# EAGLE design mc (EAGLE 4.16)
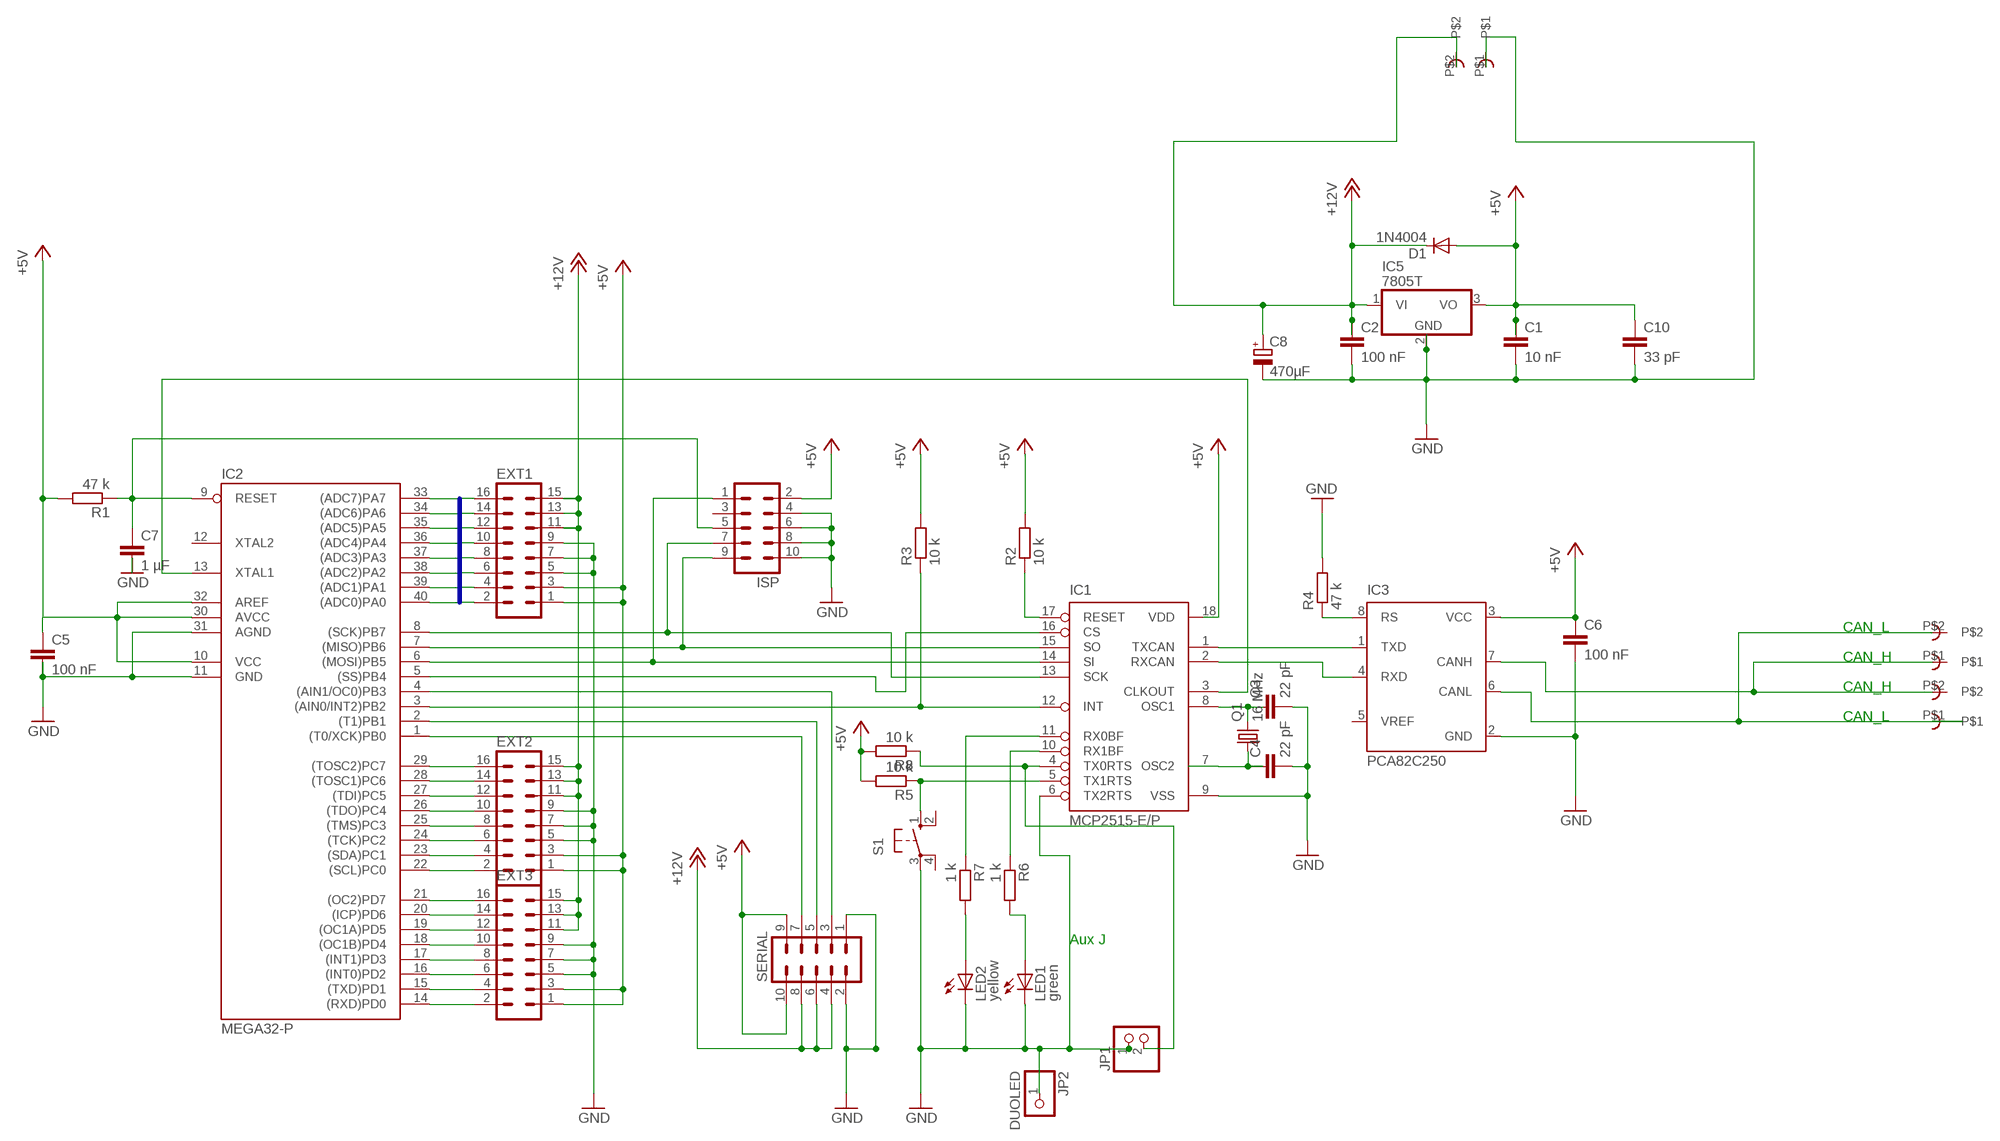
[diagram p0: schematic, sheet 1]

## Parts
C1  10 nF  C-EU025-030X050  [C025-030X050]
C2  100 nF  C-EU025-030X050  [C025-030X050]
C3  22 pF  C-EU025-030X050  [C025-030X050]
C4  22 pF  C-EU025-030X050  [C025-030X050]
C5  100 nF  C-EU025-030X050  [C025-030X050]
C6  100 nF  C-EU025-030X050  [C025-030X050]
C7  1 µF  C-EU025-030X050  [C025-030X050]
C8  470µF  CPOL-EUE2,5-6E  [E2,5-6E]
C10  33 pF  C-EU025-030X050  [C025-030X050]
CAN-1  RIACON101-2  [RIACON101-2]
CAN-2  RIACON101-2  [RIACON101-2]
D1  1N4004  [DO41-10]
EXT1  ML16  [ML16]
EXT2  ML16  [ML16]
EXT3  ML16  [ML16]
IC1  MCP2515-E/P  [DIL18]
IC2  MEGA32-P  [DIL40]
IC3  PCA82C250  [DIL08]
IC5  7805T  [TO220H]
ISP  ML10  [ML10]
JP1  PINHD-1X2  [1X02]
JP2  DUOLED  PINHD-1X1  [1X01]
LED1  green  LED3MM  [LED3MM]
LED2  yellow  LED3MM  [LED3MM]
POWER  RIACON101-2  [RIACON101-2]
Q1  16 MHz  CRYSTALHC49U70  [HC49U70]
R1  47 k  R-EU_0204/2V  [0204V]
R2  10 k  R-EU_0204/2V  [0204V]
R3  10 k  R-EU_0204/2V  [0204V]
R4  47 k  R-EU_0204/2V  [0204V]
R5  10 k  R-EU_0204/2V  [0204V]
R6  1 k  R-EU_0204/2V  [0204V]
R7  1 k  R-EU_0204/2V  [0204V]
R8  10 k  R-EU_0204/2V  [0204V]
S1  10-XX  [B3F-10XX]
SERIAL  ML10  [ML10]

## Nets
+5V: C1.1 C5.1 C6.1 C10.1 D1.A EXT1.1 EXT1.3 EXT2.1 EXT2.3 EXT3.1 EXT3.3 IC1.18(VDD) IC2.10(VCC) IC2.30(AVCC) IC2.32(AREF) IC3.3(VCC) IC5.3(VO) ISP.2 R1.2 R2.2 R3.2 R5.2 R8.2 SERIAL.9 SERIAL.10
+12V: C2.1 C8.+ D1.C EXT1.11 EXT1.13 EXT1.15 EXT2.11 EXT2.13 EXT2.15 EXT3.11 EXT3.13 EXT3.15 IC5.1(VI) POWER.P$2 SERIAL.4 SERIAL.6 SERIAL.8
AUX_JMP: IC1.4(TX0RTS) JP1.2 R8.1
BUSA0: EXT1.2 IC2.33((ADC7)PA7)
BUSA1: EXT1.4 IC2.34((ADC6)PA6)
BUSA2: EXT1.6 IC2.35((ADC5)PA5)
BUSA3: EXT1.8 IC2.36((ADC4)PA4)
BUSA4: EXT1.10 IC2.37((ADC3)PA3)
BUSA5: EXT1.12 IC2.38((ADC2)PA2)
BUSA6: EXT1.14 IC2.39((ADC1)PA1)
BUSA7: EXT1.16 IC2.40((ADC0)PA0)
CANH: CAN-1.P$1 CAN-2.P$2 IC3.7(CANH)
CANL: CAN-1.P$2 CAN-2.P$1 IC3.6(CANL)
CLOCK: IC1.3(CLKOUT) IC2.13(XTAL1)
GND: C1.2 C2.2 C3.2 C4.2 C5.2 C6.2 C7.2 C8.- C10.2 EXT1.5 EXT1.7 EXT1.9 EXT2.5 EXT2.7 EXT2.9 EXT3.5 EXT3.7 EXT3.9 IC1.6(TX2RTS) IC1.9(VSS) IC2.11(GND) IC2.31(AGND) IC3.2(GND) IC5.2(GND) ISP.4 ISP.6 ISP.8 ISP.10 JP1.1 JP2.1 LED1.K(C) LED2.K(C) POWER.P$1 R4.2 S1.3(P) SERIAL.1 SERIAL.2
INT: IC1.12(INT) IC2.3((AIN0/INT2)PB2) R3.1
LED_G: IC1.10(RX1BF) R6.1
LED_Y: IC1.11(RX0BF) R7.1
MCP_CS: IC1.16(CS) IC2.5((SS)PB4)
MISO: IC1.15(SO) IC2.7((MISO)PB6) ISP.9
MOSI: IC1.14(SI) IC2.6((MOSI)PB5) ISP.1
N$1: IC3.8(RS) R4.1
N$15: IC1.5(TX1RTS) R5.1 S1.1(S)
N$18: IC1.17(RESET) R2.1
N$28: EXT2.2 IC2.22((SCL)PC0)
N$29: EXT2.4 IC2.23((SDA)PC1)
N$30: EXT2.6 IC2.24((TCK)PC2)
N$31: EXT2.8 IC2.25((TMS)PC3)
N$32: EXT2.10 IC2.26((TDO)PC4)
N$33: EXT2.12 IC2.27((TDI)PC5)
N$34: EXT2.14 IC2.28((TOSC1)PC6)
N$35: EXT2.16 IC2.29((TOSC2)PC7)
N$36: EXT3.2 IC2.14((RXD)PD0)
N$37: EXT3.4 IC2.15((TXD)PD1)
N$38: EXT3.6 IC2.16((INT0)PD2)
N$39: EXT3.8 IC2.17((INT1)PD3)
N$40: EXT3.10 IC2.18((OC1B)PD4)
N$41: EXT3.12 IC2.19((OC1A)PD5)
N$42: EXT3.14 IC2.20((ICP)PD6)
N$43: EXT3.16 IC2.21((OC2)PD7)
N$46: LED2.A R7.2
N$47: LED1.A R6.2
OSC1: C3.1 IC1.8(OSC1) Q1.2
OSC2: C4.1 IC1.7(OSC2) Q1.1
RESET: C7.1 IC2.9(RESET) ISP.5 R1.1
RXCAN: IC1.2(RXCAN) IC3.4(RXD)
SCK: IC1.13(SCK) IC2.8((SCK)PB7) ISP.7
SERIAL_1: IC2.4((AIN1/OC0)PB3) SERIAL.3
SERIAL_2: IC2.2((T1)PB1) SERIAL.5
SERIAL_3: IC2.1((T0/XCK)PB0) SERIAL.7
TXCAN: IC1.1(TXCAN) IC3.1(TXD)
Unconnected: IC2.12(XTAL2) IC3.5(VREF) ISP.3 S1.2(S1) S1.4(P1)

## Buses
BUSA[0..7]

## Notes on the sheet
- CAN_L
- CAN_H
- CAN_H
- CAN_L
- Aux J

## Library data of the parts
C1-C7 C10 = rcl:C-EU: CAPACITOR, European symbol
C8 = rcl:CPOL-EU: POLARIZED CAPACITOR, European symbol
CAN-1 CAN-2 POWER = con-riacon101-v2:RIACON101-2: Riaconn Schreaubklemme 101
D1 = diode:1N4004: DIODE general purpose rectifier, 1 A
EXT1-EXT3 = con-harting-ml:ML16: HARTING
IC1 = mcp2515:MCP2515
IC2 = atmel:MEGA32-P: MICROCONTROLLER 32 Kbytes FLASH 2 Kbytes SRAM 1 Kbytes EEPROM USART 8-channel 10 bit ADC Source: www.atmel.com .. doc2503.pdf
IC3 = micro-philips:PCA82C250: CAN CONTROLLER INTERFACE
IC5 = linear:78*: Positive VOLTAGE REGULATOR Source: http://cache.national.com/ds/LM/LM78L05.pdf http://www.fairchildsemi.com/ds/LM/LM7805.pdf
ISP SERIAL = con-harting-ml:ML10: HARTING
JP1 = pinhead:PINHD-1X2: PIN HEADER
JP2 = pinhead:PINHD-1X1: PIN HEADER
LED1 LED2 = led:LED: LED OSRAM: - CHIPLED LG R971, LG N971, LY N971, LG Q971, LY Q971, LO R971, LY R971 LH N974, LH R974 LS Q976, LO Q976, LY Q976 LO Q996 - Hyper CHIPLED LW Q18S LB Q993, LB Q99A, LB R99A - SideLED LS A670, LO A670, LY A670, LG A670, LP A670 LB A673, LV A673, LT A673, LW A673 LH A674 LY A675 LS A676, LA A676, LO A676, LY A676, LW A676 LS A679, LY A679, LG A679 - Hyper Micro SIDELED® LS Y876, LA Y876, LO Y876, LY Y876 LT Y87S - SmartLED LW L88C, LW L88S LB L89C, LB L89S, LG L890 LS L89K, LO L89K, LY L89K LS L896, LA L896, LO L896, LY L896 - TOPLED LS T670, LO T670, LY T670, LG T670, LP T670 LSG T670, LSP T670, LSY T670, LOP T670, LYG T670 LG T671, LOG T671, LSG T671 LB T673, LV T673, LT T673, LW T673 LH T674 LS T676, LA T676, LO T676, LY T676, LB T676, LH T676, LSB T676, LW T676 LB T67C, LV T67C, LT T67C, LS T67K, LO T67K, LY T67K, LW E67C LS E67B, LA E67B, LO E67B, LY E67B, LB E67C, LV E67C, LT E67C LW T67C LS T679, LY T679, LG T679 LS T770, LO T770, LY T770, LG T770, LP T770 LB T773, LV T773, LT T773, LW T773 LH T774 LS E675, LA E675, LY E675, LS T675 LS T776, LA T776, LO T776, LY T776, LB T776 LHGB T686 LT T68C, LB T68C - Hyper Mini TOPLED® LB M676 - Mini TOPLED Santana® LG M470 LS M47K, LO M47K, LY M47K Source: http://www.osram.convergy.de/
Q1 = crystal:CRYSTAL: CRYSTAL
R1-R8 = rcl:R-EU_: RESISTOR, European symbol
S1 = switch-omron:10-XX: OMRON SWITCH

## Board
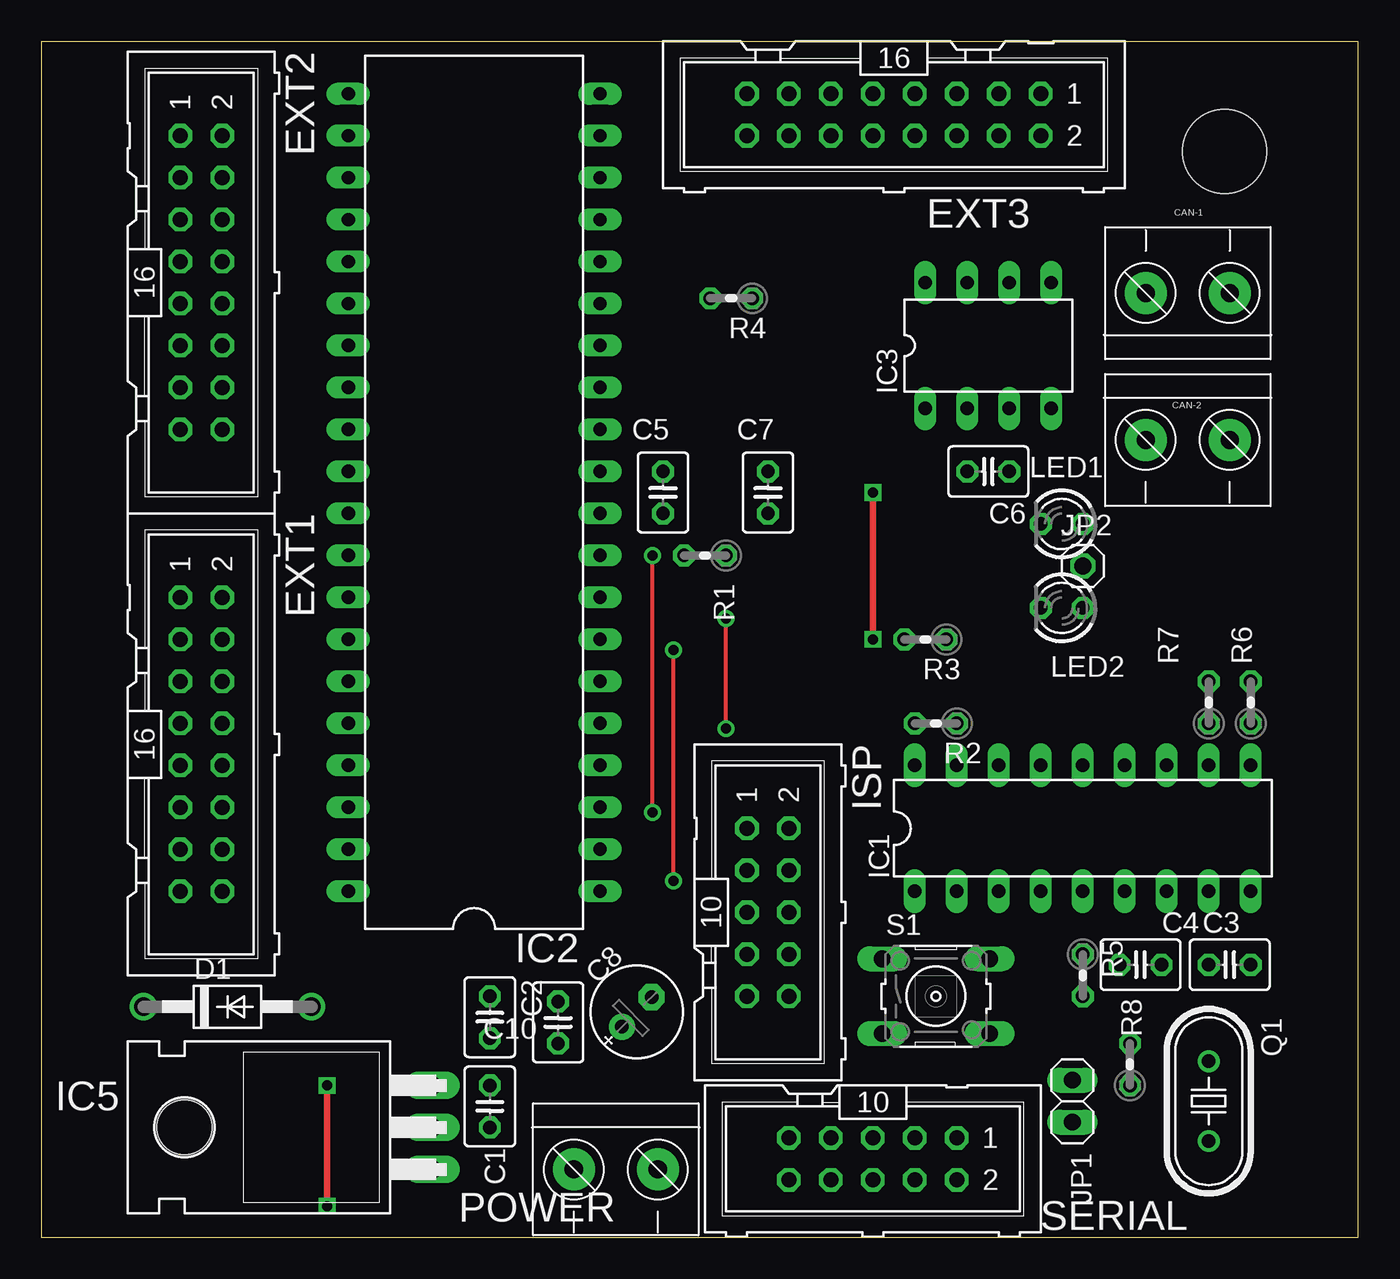
[diagram p1: board, top side]
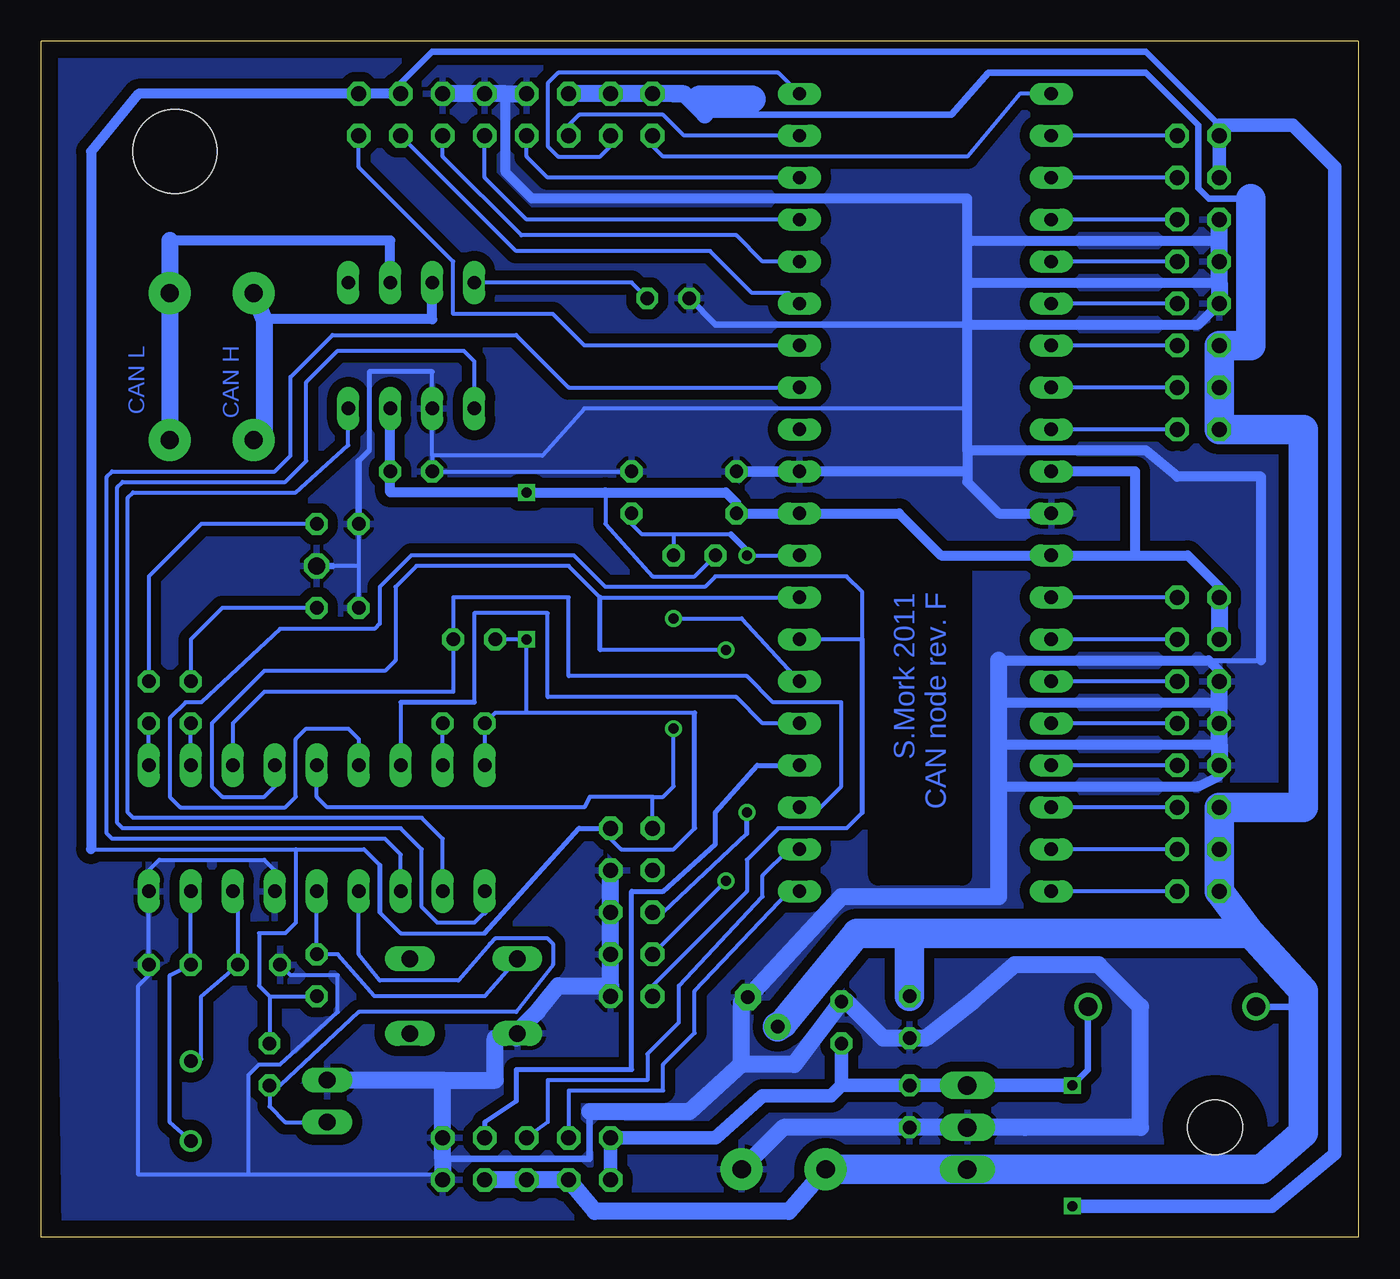
[diagram p2: board, bottom side, seen from below]

Size 79.68 x 72.38 mm. Coordinates in mm from the lower left corner, seen from the top.
Outline: 79.68,72.38 79.68,0 0,0 0,72.38
Outline: 0,72.38 79.68,72.38
Copper layers (1*16): Top 0.035mm / dielectric 1.5mm / Bottom 0.035mm
Design rules "default": minimum track width 10mil, minimum drill 24mil, track to track 8mil, track to pad 8mil, pad to pad 8mil, via to via 8mil, smd to smd 8mil, copper to edge 40mil, drill to drill 8mil, minimum pad ring 10mil, minimum via ring 8mil, stop-mask expansion 4mil, vias tented up to drill 0mil, thermal gap 10mil
Holes 5.08 mm at 71.59,65.72
tRestrict: area 0.2,0 to 5.2,72.4; area 7.1,19.7 to 12.2,40; area 7.1,47.6 to 12.2,67.9; area 51.6,29.8 to 56.7,32.4; area 51.6,19.7 to 74.4,22.2; area 47.1,56.5 to 62.4,59.1; area 52.2,48.9 to 62.4,51.4; area 31.3,19.7 to 36.3,70.5; area 17.3,19.7 to 21.1,70.5; area 64.3,15.9 to 74.4,18.4; area 61.7,14.6 to 64.3,19.7; area 51.6,27.3 to 74.4,29.8; 21 more areas
bRestrict: area 73.2,50.8 to 75.1,54; area 67.5,50.8 to 69.4,54; area 24,21.9 to 29,40.3

### Footprints (pad centres in the part's own frame; a part is rotated, then mirrored left to right if it is on the bottom)
C025-030X050 = drill 0.813 octagon: 1 -1.27,0; 2 1.27,0
E2,5-6E = drill 0.813 pad 1.575 round: + -1.27,0 | drill 0.813 pad 1.575 octagon: - 1.27,0
RIACON101-2 = drill 1.1 pad 2.54 round: P$1 0,2.54; P$2 0,-2.54
DO41-10 = drill 1.118 round: A 5.08,0; C -5.08,0
ML16 = drill 0.914 octagon: 1 -8.89,-1.27; 2 -8.89,1.27; 3 -6.35,-1.27; 4 -6.35,1.27; 5 -3.81,-1.27; 6 -3.81,1.27; 7 -1.27,-1.27; 8 -1.27,1.27; 9 1.27,-1.27; 10 1.27,1.27; 11 3.81,-1.27; 12 3.81,1.27; 13 6.35,-1.27; 14 6.35,1.27; 15 8.89,-1.27; 16 8.89,1.27
DIL18 = drill 0.813 long: 1 -10.16,-3.81; 2 -7.62,-3.81; 3 -5.08,-3.81; 4 -2.54,-3.81; 5 0,-3.81; 6 2.54,-3.81; 7 5.08,-3.81; 8 7.62,-3.81; 9 10.16,-3.81; 10 10.16,3.81; 11 7.62,3.81; 12 5.08,3.81; 13 2.54,3.81; 14 0,3.81; 15 -2.54,3.81; 16 -5.08,3.81; 17 -7.62,3.81; 18 -10.16,3.81
DIL40 = drill 0.813 long: 1 -24.13,-7.62; 2 -21.59,-7.62; 3 -19.05,-7.62; 4 -16.51,-7.62; 5 -13.97,-7.62; 6 -11.43,-7.62; 7 -8.89,-7.62; 8 -6.35,-7.62; 9 -3.81,-7.62; 10 -1.27,-7.62; 11 1.27,-7.62; 12 3.81,-7.62; 13 6.35,-7.62; 14 8.89,-7.62; 15 11.43,-7.62; 16 13.97,-7.62; 17 16.51,-7.62; 18 19.05,-7.62; 19 21.59,-7.62; 20 24.13,-7.62; 21 24.13,7.62; 22 21.59,7.62; 23 19.05,7.62; 24 16.51,7.62; 25 13.97,7.62; 26 11.43,7.62; 27 8.89,7.62; 28 6.35,7.62; 29 3.81,7.62; 30 1.27,7.62; 31 -1.27,7.62; 32 -3.81,7.62; 33 -6.35,7.62; 34 -8.89,7.62; 35 -11.43,7.62; 36 -13.97,7.62; 37 -16.51,7.62; 38 -19.05,7.62; 39 -21.59,7.62; 40 -24.13,7.62
DIL08 = drill 0.813 long: 1 -3.81,-3.81; 2 -1.27,-3.81; 3 1.27,-3.81; 4 3.81,-3.81; 5 3.81,3.81; 6 1.27,3.81; 7 -1.27,3.81; 8 -3.81,3.81
TO220H = drill 1.118 long: 1 -2.54,-10.16; 2 0,-10.16; 3 2.54,-10.16 | hole 3.302: 0,4.826
ML10 = drill 0.914 octagon: 1 -5.08,-1.27; 2 -5.08,1.27; 3 -2.54,-1.27; 4 -2.54,1.27; 5 0,-1.27; 6 0,1.27; 7 2.54,-1.27; 8 2.54,1.27; 9 5.08,-1.27; 10 5.08,1.27
1X02 = drill 1.016 long: 1 -1.27,0; 2 1.27,0
1X01 = drill 1.016 octagon: 1 0,0
LED3MM = drill 0.813 octagon: A -1.27,0; K 1.27,0
HC49U70 = drill 0.813 round: 1 -2.413,0; 2 2.413,0
0204V = drill 0.813 octagon: 1 -1.27,0; 2 1.27,0
B3F-10XX = drill 1.016 long: 1 -3.251,2.261; 2 3.251,2.261; 3 -3.251,-2.261; 4 3.251,-2.261

### Placement (x,y rotation side)
C1  27.14,7.93 270 top
C2  27.14,13.33 270 top
C3  71.91,16.51 0 top
C4  66.51,16.51 180 top
C5  37.62,45.08 90 top
C6  57.3,46.35 180 top
C7  43.97,45.08 90 top
C8  36.03,13.65 45 top
C10  31.27,13.01 90 top
CAN-1  69.37,57.15 90 top
CAN-2  69.37,48.25 270 top
D1  11.27,13.96 0 top
EXT1  9.68,29.84 270 top
EXT2  9.68,57.78 270 top
EXT3  51.59,67.94 180 top
IC1  63.02,24.76 0 top
IC2  26.19,45.08 90 top
IC3  57.3,53.97 0 top
IC5  13.49,6.66 90 top
ISP  43.97,19.68 270 top
JP1  62.38,8.25 270 top
JP2  63.02,40.63 0 top
LED1  61.75,43.17 180 top
LED2  61.75,38.09 180 top
POWER  34.76,4.12 270 top
Q1  70.64,8.25 270 top
R1  40.16,41.27 180 top
R2  54.13,31.11 180 top
R3  53.49,36.19 180 top
R4  41.75,56.83 180 top
R5  63.02,15.87 270 top
R6  73.18,32.38 90 top
R7  70.64,32.38 90 top
R8  65.88,10.47 90 top
S1  54.13,14.6 0 top
SERIAL  50.32,4.76 180 top

### Tracks (layer width: path | path; a pad name or v marks a point on that pad's centre or on a via)
+5V  (via drill 0.6)
  Top 0.406: v50.32,36.19 v50.32,45.08 | v17.3,1.9 v17.3,9.2
  Bottom 0.254: IC1.18 R2.2 52.22,31.74 50.32,31.74 | IC2.32 17.93,41.27 | 40.16,24.76 41.43,23.49 44.6,23.49 45.24,24.12 ISP.2 | 65.87,14.6 R5.2 | 37.62,44.45 C5.1 | 50.32,31.74 v50.32,36.19 R3.2 | 76.67,23.49 64.29,23.49 | 64.29,23.49 60.16,23.49 59.21,22.54 | 59.21,19.68 57.94,18.41 52.86,18.41 | 40.16,31.74 50.32,31.74 | 65.87,14.6 66.51,15.24 66.51,18.41 64.92,18.41 64.29,19.05 64.29,23.49 | R1.2 40.16,40 42.7,40 45.55,43.17 45.55,45.08 | 65.87,14.6 R8.2
  Bottom 0.305: 59.21,22.54 59.21,19.68 | 40.16,24.76 40.16,31.74 | 52.86,18.41 47.14,24.76 ISP.2
  Bottom 0.406: 8.41,67.31 12.85,71.75 56.03,71.75 57.94,69.84 EXT3.3 | 8.41,39.36 EXT1.1 | D1.A 16.35,10.15 v17.3,9.2
  Bottom 0.61: EXT3.3 EXT3.1 73.81,69.21 76.67,65.72 76.67,23.49 | C5.1 IC2.10 27.77,43.81 25.24,41.27 IC2.32 13.49,41.27 | 13.49,41.27 13.49,46.35 IC2.30 | 17.93,41.27 13.49,41.27 | 37.62,44.45 38.25,45.08 45.55,45.08 v50.32,45.08 58.57,45.08 C6.1 IC3.3 | 13.49,41.27 10.31,41.27 8.41,39.36
  Bottom 0.813: EXT2.3 EXT2.1 8.41,67.31 3.96,67.31 1.42,64.77 1.42,5.07 5.23,1.9 v17.3,1.9 | SERIAL.10 SERIAL.9 38.89,6.03 36.03,8.57 31.9,8.57 31.27,9.2 | v17.3,9.2 IC5.3 C1.1 31.27,9.2 | 31.27,9.2 C10.1
  Bottom 1.016: EXT1.1 EXT1.3
+12V
  Bottom 0.406: 6.5,62.86 9.04,62.86 9.68,63.49 9.68,67.31 12.85,70.48 22.38,70.48 24.6,67.94 39.52,67.94 | 39.84,68.89 41.43,68.89 41.43,69.21 | 3.33,13.96 D1.C
  Bottom 1.016: EXT3.11 EXT3.13 EXT3.15 41.43,69.21 40.79,69.21 39.52,67.94 | SERIAL.4 SERIAL.6 SERIAL.8 46.19,1.58 34.44,1.58 POWER.P$2
  Bottom 1.676: 39.84,68.89 36.66,68.89
  Bottom 1.778: 6.5,62.86 6.5,53.97 EXT2.11 EXT2.13 EXT2.15 3.33,48.89 3.33,26.03 EXT1.11 EXT1.13 EXT1.15 6.5,18.41 | POWER.P$2 IC5.1 5.87,4.12 3.33,6.35 3.33,13.96 3.33,14.92 6.5,18.41 | 27.14,18.41 C2.1 | 6.5,18.41 27.14,18.41 | C8.+ 34.81,12.96 30.32,18.41 27.14,18.41
AUX_JMP
  Bottom 0.254: JP1.2 64.92,6.98 65.87,7.93 R8.1 65.24,9.2 60.48,13.65 50.95,13.65 48.73,16.51 48.73,17.77 49.05,18.09 52.22,18.09 52.54,17.77 54.44,15.55 59.21,15.55 60.48,17.14 IC1.4
BUSA0
  Bottom 0.254: EXT1.2 IC2.33
BUSA1
  Bottom 0.254: EXT1.4 IC2.34
BUSA2
  Bottom 0.254: EXT1.6 IC2.35
BUSA3
  Bottom 0.254: EXT1.8 IC2.36
BUSA4
  Bottom 0.254: EXT1.10 IC2.37
BUSA5
  Bottom 0.254: EXT1.12 IC2.38
BUSA6
  Bottom 0.254: EXT1.14 IC2.39
BUSA7
  Bottom 0.254: EXT1.16 IC2.40
CANH
  Bottom 0.61: IC3.7 56.03,55.56 66.19,55.56
  Bottom 0.813: 66.19,48.89 CAN-2.P$2
  Bottom 1.016: CAN-1.P$1 66.19,55.56 66.19,48.89
CANL
  Bottom 0.61: 71.91,60.32 58.57,60.32 IC3.6
  Bottom 1.016: 71.91,60.32 CAN-1.P$2 CAN-2.P$1
CLOCK
  Bottom 0.254: IC1.3 57.94,23.17 58.89,24.12 75.4,24.12 75.72,24.44 75.72,46.03 75.4,46.35 65.56,46.35 64.61,47.3 64.61,52.06 62.07,54.6 50.95,54.6 47.78,51.43 IC2.13
GND
  Bottom 0.254: 55.4,3.8 67.14,3.8 | 67.14,3.8 73.81,3.8 73.81,15.24 73.18,15.87 C3.2 IC1.9 73.18,22.22 72.54,22.85 66.19,22.85 65.56,22.22 IC1.6 | C4.2 64.61,15.87 61.75,15.87 61.75,13.65 65.24,10.47 66.51,10.47 67.14,9.84 67.14,3.8 | 45.24,15.24 ISP.10 | LED1.K 60.48,40.63 | 60.48,40.63 LED2.K | C7.2 C6.2 56.03,47.3 | 23.65,50.16 46.83,50.16 49.36,47.3 56.03,47.3 | 56.03,52.38 IC3.2 56.03,47.3 | 60.48,40.63 62.07,40.63 62.38,40.63 | 50.95,12.38 50.91,12.34 S1.3
  Bottom 0.305: 60.48,46.98 59.84,47.62 59.84,52.38 56.03,52.38 | 21.74,34.92 5.87,34.92
  Bottom 0.406: EXT1.5 8.41,34.28 | 8.41,27.93 EXT1.9 | 23.65,55.24 38.89,55.24 R4.2 | 60.48,46.98 LED1.K | S1.3 50.95,12.34 | 62.07,40.63 JP2.1 | 55.4,4.76 46.51,4.76 46.51,7.62 | SERIAL.2 55.72,3.17 | 20.15,6.66 IC5.2 C1.2
  Bottom 0.61: IC2.11 C5.2 23.65,46.35 | 8.41,34.28 9.04,34.92 21.74,34.92 | IC2.31 21.74,43.81 23.65,45.71 23.65,46.35 | 23.65,47.62 23.65,46.35 | 23.65,47.62 23.65,50.16 23.65,55.24 | 51.59,69.21 51.59,64.45 50,62.86 23.65,62.86 23.65,60.32 | 23.65,55.24 9.68,55.24 EXT2.9 | 8.41,27.93 9.68,27.3 21.74,27.3 | 23.65,55.24 23.65,57.78 | 23.65,57.78 23.65,60.32 | 23.65,60.32 8.41,60.32 | 21.74,32.38 8.41,32.38 | 21.74,29.84 8.41,29.84 | 23.65,57.78 8.41,57.78 | 5.87,34.92 5.87,46.03 10.95,46.03 12.85,47.62 23.65,47.62
  Bottom 1.016: ISP.4 ISP.6 ISP.8 45.24,15.24 48.41,15.24 49.68,13.65 50.95,12.38 | EXT1.9 8.41,29.84 EXT1.7 8.41,32.38 EXT1.5 | EXT3.9 51.59,69.21 EXT3.7 EXT3.5 | SERIAL.2 55.4,3.8 55.4,4.76 SERIAL.1 55.4,9.52 | 55.4,9.52 52.22,9.52 52.22,12.06 S1.3 | 55.4,9.52 JP1.1 | EXT2.9 8.41,57.78 EXT2.7 8.41,60.32 EXT2.5 | 21.74,34.92 21.74,32.38 21.74,29.84 21.74,27.3 21.74,20.63 31.27,20.63 C8.- 37.04,14.54 37.3,14.28 37.3,10.47 | 50.95,12.34 50.95,12.06 | 37.3,10.47 34.12,10.47 C10.2 30.95,14.28 28.73,12.06 C2.2 26.19,12.06 23.33,14.28 20.79,16.51 15.71,16.51 13.17,13.96 13.17,6.66 20.15,6.66 C1.2 34.76,6.66 POWER.P$1 | 46.51,7.62 40.47,7.62 37.3,10.47
  pour Bottom (isolate 0.61): 0.15,72.7 79.21,72.7 78.26,0.31 0.15,0
INT
  Bottom 0.254: IC1.12 68.1,31.11 66.19,33.02 54.76,33.02 R3.1 54.76,38.73 47.78,38.73 47.78,33.97 36.98,33.97 35.4,32.38 31.27,32.38 31.27,27.3 32.54,26.03 IC2.3
LED_G
  Bottom 0.254: IC1.10 R6.1
LED_Y
  Bottom 0.254: IC1.11 R7.1
MCP_CS
  Bottom 0.254: 53.49,32.38 53.49,37.78 49.05,37.78 49.05,32.7 37.62,32.7 36.03,31.11 IC2.5 | 57.94,32.38 IC1.16
  Bottom 0.305: 53.49,32.38 57.94,32.38
MISO
  Bottom 0.254: 30,25.71 30.95,24.76 35.08,24.76 36.98,22.85 36.98,20.95 42.7,15.24 ISP.9 | IC2.7 30,36.19 30,39.05 30.95,40 38.89,40 39.52,39.36 45.55,39.36 47.46,41.27 57.3,41.27 59.21,39.36 59.21,37.14 59.53,36.82 65.24,36.82 70,32.38 70.95,32.38 71.91,31.43 71.91,26.66 71.27,26.03 64.92,26.03 64.29,26.66 64.29,30.16 63.65,30.79 61.11,30.79 60.48,30.16 IC1.15
  Bottom 0.305: 30,25.71 30,36.19
MOSI  (via drill 0.61)
  Top 0.254: v41.43,30.79 v41.43,37.46
  Bottom 0.254: 42.7,26.66 46.51,26.66 46.83,26.03 62.38,26.03 63.02,26.66 IC1.14 | ISP.1 42.7,26.66 | 42.7,26.66 42.06,26.66 41.43,27.3 v41.43,30.79 | v41.43,37.46 37.3,37.46 IC2.6
N$1
  Bottom 0.254: R4.1 43.97,57.78 IC3.8
N$15
  Bottom 0.254: 63.02,20.31 R5.1 61.75,17.14 59.53,14.6 52.86,14.6 S1.1 | 63.02,20.31 63.02,19.68 | 63.02,20.31 IC1.5
N$18
  Bottom 0.254: IC1.17 R2.1
N$28
  Bottom 0.254: EXT2.2 IC2.22
N$29
  Bottom 0.254: EXT2.4 IC2.23
N$30
  Bottom 0.254: EXT2.6 IC2.24
N$31
  Bottom 0.254: EXT2.8 IC2.25
N$32
  Bottom 0.254: EXT2.10 IC2.26
N$33
  Bottom 0.254: EXT2.12 IC2.27
N$34
  Bottom 0.254: EXT2.14 IC2.28
N$35
  Bottom 0.254: EXT2.16 IC2.29
N$36
  Bottom 0.254: IC2.14 46.83,53.97 48.73,55.88 54.76,55.88 54.76,59.05 60.48,64.77 EXT3.2
N$37
  Bottom 0.254: EXT3.4 50.95,59.68 39.21,59.68 36.66,57.15 34.44,57.15 IC2.15
N$38
  Bottom 0.254: IC2.16 36.03,59.05 37.62,60.64 50.64,60.64 55.4,65.4 EXT3.6
N$39
  Bottom 0.254: IC2.17 50.32,61.59 52.86,64.13 EXT3.8
N$40
  Bottom 0.254: IC2.18 49.05,64.13 50.32,65.4 EXT3.10
N$41
  Bottom 0.254: IC2.19 40.79,66.67 42.06,67.94 47.14,67.94 47.78,67.31 EXT3.12
N$42
  Bottom 0.254: IC2.20 35.08,70.48 48.41,70.48 49.05,69.84 49.05,66.04 48.41,65.4 45.87,65.4 45.24,66.04 EXT3.14
N$43
  Bottom 0.254: IC2.21 20.47,69.21 23.65,65.4 42.06,65.4 42.7,66.04 EXT3.16
N$46
  Bottom 0.254: R7.2 70.64,36.19 68.73,38.09 LED2.A
N$47
  Bottom 0.254: R6.2 73.18,40 70,43.17 LED1.A
OSC1
  Bottom 0.254: IC1.8 C3.1 71.91,15.87 71.91,6.98 Q1.2
OSC2
  Bottom 0.254: IC1.7 67.78,20.63 C4.1 70,14.6 70,10.79 Q1.1
RESET  (via drill 0.61)
  Top 0.254: v36.98,25.71 v36.98,41.27
  Bottom 0.254: 37.94,42.54 41.43,42.54 | 41.43,42.54 R1.1 | 41.43,42.54 43.33,42.54 43.97,43.17 C7.1 | ISP.5 42.06,19.68 36.98,24.44 | 36.66,41.27 IC2.9
  Bottom 0.305: 36.98,24.44 v36.98,25.71
  Bottom 0.406: v36.98,41.27 36.66,41.27 37.94,42.54
RXCAN
  Bottom 0.254: IC1.2 55.4,24.12 56.67,25.39 74.13,25.39 74.45,25.71 74.45,44.76 74.13,45.08 64.29,45.08 61.11,47.94 IC3.4
SCK  (via drill 0.61)
  Top 0.254: v38.25,21.59 v38.25,35.55
  Bottom 0.254: IC2.8 45.87,38.73 47.78,40.63 56.98,40.63 58.26,39.36 58.26,34.92 58.89,34.28 66.19,34.28 69.37,31.11 69.37,27.3 68.73,26.66 66.19,26.66 65.56,27.3 IC1.13 | ISP.7 v38.25,21.59 | v38.25,35.55 45.87,35.55
  Bottom 0.305: 45.87,35.55 45.87,38.73
SERIAL_1
  Bottom 0.305: SERIAL.3 52.86,6.98 50.95,8.25 50.95,10.15 43.97,10.15 43.97,20.95 42.06,20.95 38.89,23.81 38.89,25.71 36.35,28.57 IC2.4
SERIAL_2
  Bottom 0.254: 34.44,23.49 36.03,21.9 36.03,20.63 41.11,15.24 41.11,13.01 43.01,11.11 43.01,9.52 49.05,9.52 49.05,6.98 SERIAL.5
  Bottom 0.305: 34.44,23.49 IC2.2
SERIAL_3
  Bottom 0.254: SERIAL.7 47.78,8.88 42.06,8.88 42.06,10.47 40.16,12.38 40.16,14.92 34.44,20.95
  Bottom 0.305: 34.44,20.95 IC2.1
TXCAN
  Bottom 0.254: 52.86,19.68 53.49,19.05 55.72,19.05 56.67,20 56.67,23.49 57.94,24.76 74.76,24.76 75.08,25.08 75.08,45.4 74.76,45.71 64.92,45.71 63.65,46.98 63.65,51.75 61.75,53.65 54.13,53.65 53.49,53.02 IC3.1
  Bottom 0.406: 52.86,19.68 IC1.1

### Text on the board
Bottom: CAN H | CAN L | CAN node rev. F | S.Mork 2011